# Altium project MelansonTech Isolated Current Sense.PrjPcb
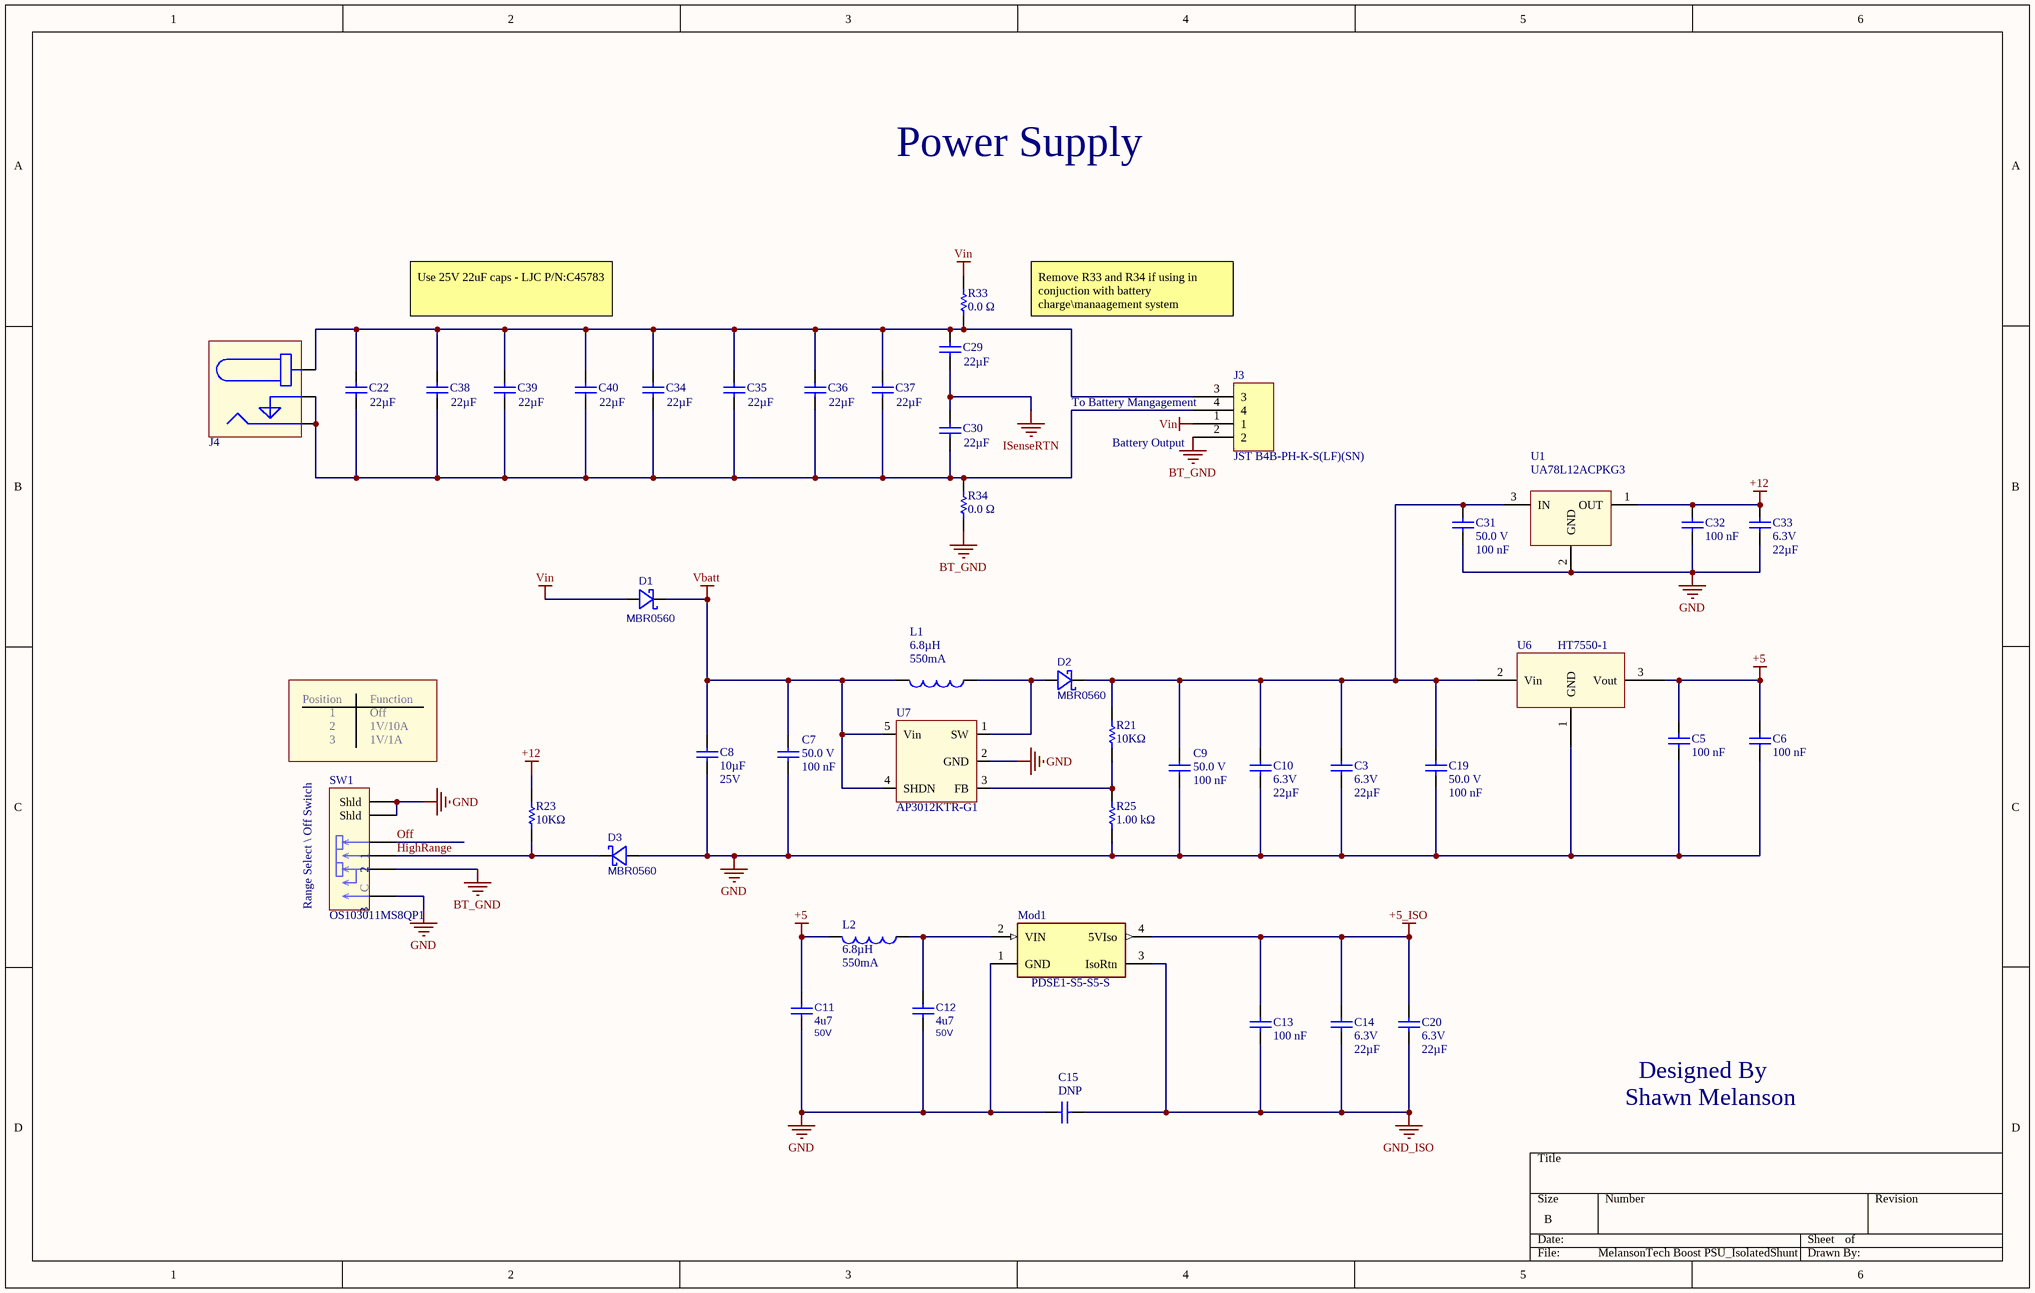
[diagram p0: MelansonTech Boost PSU_IsolatedShuntAmp.SchDoc]
2 sheets, 102 parts. Net scope: global (net labels, ports and power ports of the same name join across sheets).
Sheets:
  MelansonTech Boost PSU_IsolatedShuntAmp.SchDoc
  MelansonTech Isolated Shunt Amplifier.SchDoc

## Sheet MelansonTech Boost PSU_IsolatedShuntAmp.SchDoc
size B

### Parts
C3  Voltage - Rated: 6.3V  Capacitance: 22µF  [Cap,0805]  (hidden comment: CL21A226MQQNNNE)
C5  Capacitance: 100 nF  [CAP, 0805, HD]  (hidden comment: 08055C104JAT2A)
C6  Capacitance: 100 nF  [CAP, 0805, HD]  (hidden comment: 08055C104JAT2A)
C7  Voltage Rating (DC): 50.0 V  Capacitance: 100 nF  [Cap,0805]  (hidden comment: Cap)
C8  Capacitance: 10µF  Voltage - Rated: 25V  [Cap, 1206]  (hidden comment: C3216X7R1E106K160AB)
C9  Voltage Rating (DC): 50.0 V  Capacitance: 100 nF  [Cap,0805]  (hidden comment: Cap)
C10  Voltage - Rated: 6.3V  Capacitance: 22µF  [Cap,0805]  (hidden comment: CL21A226MQQNNNE)
C11  Capacitance: 4u7  Voltage: 50V  [Cap, 1206]  (hidden comment: CL31B475KBHNNNE)
C12  Capacitance: 4u7  Voltage: 50V  [Cap, 1206]  (hidden comment: CL31B475KBHNNNE)
C13  Capacitance: 100 nF  [CAP, 0805, HD]  (hidden comment: 08055C104JAT2A)
C14  Voltage - Rated: 6.3V  Capacitance: 22µF  [Cap,0805]  (hidden comment: CL21A226MQQNNNE)
C15  S102K33Y5PP63K5R  [Cap, 5mm Lead Spaceing, 4mm dai]  (value not drawn)
C19  Voltage Rating (DC): 50.0 V  Capacitance: 100 nF  [Cap,0805]  (hidden comment: Cap)
C20  Voltage - Rated: 6.3V  Capacitance: 22µF  [Cap,0805]  (hidden comment: CL21A226MQQNNNE)
C22  Capacitance: 22µF  [Cap,0805]  (hidden comment: CL21A226MQQNNNE)
C29  Capacitance: 22µF  [Cap,0805]  (hidden comment: CL21A226MQQNNNE)
C30  Capacitance: 22µF  [Cap,0805]  (hidden comment: CL21A226MQQNNNE)
C31  Voltage Rating (DC): 50.0 V  Capacitance: 100 nF  [Cap,0805]  (hidden comment: Cap)
C32  Capacitance: 100 nF  [CAP, 0805, HD]  (hidden comment: 08055C104JAT2A)
C33  Voltage - Rated: 6.3V  Capacitance: 22µF  [Cap,0805]  (hidden comment: CL21A226MQQNNNE)
C34  Capacitance: 22µF  [Cap,0805]  (hidden comment: CL21A226MQQNNNE)
C35  Capacitance: 22µF  [Cap,0805]  (hidden comment: CL21A226MQQNNNE)
C36  Capacitance: 22µF  [Cap,0805]  (hidden comment: CL21A226MQQNNNE)
C37  Capacitance: 22µF  [Cap,0805]  (hidden comment: CL21A226MQQNNNE)
C38  Capacitance: 22µF  [Cap,0805]  (hidden comment: CL21A226MQQNNNE)
C39  Capacitance: 22µF  [Cap,0805]  (hidden comment: CL21A226MQQNNNE)
C40  Capacitance: 22µF  [Cap,0805]  (hidden comment: CL21A226MQQNNNE)
D1  MBR0560  [SOD123]
D2  MBR0560  [SOD123]
D3  MBR0560  [SOD123]
J3  JST B4B-PH-K-S(LF)(SN)  [Conn, JST, 4 pin, 2mm spacing Right Angle]
J4  PJ-002A  [Connector,Barrel,2.1mm,5.5mm,DC power Jack]  (value not drawn)
L1  Inductance: 6.8µH  Current Rating (Amps): 550mA  [Ind, 0805]  (hidden comment: MLZ2012N6R8LT000)
L2  Inductance: 6.8µH  Current Rating (Amps): 550mA  [Ind, 0805]  (hidden comment: MLZ2012N6R8LT000)
Mod1  PDSE1-S5-S5-S  [CONV_PDSE1-S5-S5-S]
R21  Resistance: 10KΩ  [res, 0805, HD]  (hidden comment: Vishay / Dale CRCW080510K0FKTA)
R23  Resistance: 10KΩ  [res, 0805, HD]  (hidden comment: Vishay / Dale CRCW080510K0FKTA)
R25  Resistance: 1.00 kΩ  [res, 0805, HD]  (hidden comment: Vishay CRCW08051K00JNEA)
R33  Resistance: 0.0 Ω  [res, 0805, HD]  (hidden comment: CR0805-J/-000ELF)
R34  Resistance: 0.0 Ω  [res, 0805, HD]  (hidden comment: CR0805-J/-000ELF)
SW1  OS103011MS8QP1  [Switch,Slide,.SP3T, OS103011 -Side]
U1  UA78L12ACPKG3  [SOT89-3]
U6  HT7550-1  [SOT89-3]
U7  AP3012KTR-G1  [SOT23-5]

### Nets
+5: C5.2 C6.2 C11.2 L2.2 U6.3(Vout)
+5_ISO: C13.2 C14.2 C20.2 Mod1.4(5VIso)
+12: C32.2 C33.2 R23.1 U1.1(OUT)
BT_GND: J3.2 R34.2 SW1.2
GND: C3.1 C5.1 C6.1 C7.1 C8.1 C9.1 C10.1 C11.1 C12.1 C15.2 C19.1 C31.1 C32.1 C33.1 D3.2(A) Mod1.1(GND) R25.2 SW1.1 SW1.5(Shld) SW1.6(Shld) U1.2(GND) U6.1(GND) U7.2(GND)
GND_ISO: C13.1 C14.1 C15.1 C20.1 Mod1.3(IsoRtn)
ISenseRTN: C29.1 C30.2
Vbatt: C7.2 C8.2 D1.1(C) L1.2 U7.4(SHDN) U7.5(Vin)
Vin: D1.2(A) J3.1 R33.1
HighRange: D3.1(C) R23.2 SW1.3
Off: SW1.4
NetC3_2: C3.2 C9.2 C10.2 C19.2 C31.2 D2.1(C) R21.2 U1.3(IN) U6.2(Vin)
NetC12_2: C12.2 L2.1 Mod1.2(VIN)
NetC22_1: C22.1 C30.1 C34.1 C35.1 C36.1 C37.1 C38.1 C39.1 C40.1 J3.4 J4.2 J4.3 R34.1
NetC22_2: C22.2 C29.2 C34.2 C35.2 C36.2 C37.2 C38.2 C39.2 C40.2 J3.3 J4.1 R33.2
NetD2_2: D2.2(A) L1.1 U7.1(SW)
NetR21_1: R21.1 R25.1 U7.3(FB)

### Notes on the sheet
- Power Supply
- Use 25V 22uF caps - LJC P/N:C45783
- Remove R33 and R34 if using in conjuction with battery charge\manaagement system
- (near J3) To Battery Mangagement
- (near J3) Battery Output
- Position
- Function
- 1
- 2
- 3
- Off
- 1V/10A
- 1V/1A
- Range Select \ Off Switch
- (near C15) DNP
- Shawn Melanson
- Designed By
- (in symbol Switch,TH,Slide,SP3T,100MA,12V,OS103011MS8QP1) C

### Library data of the parts
C3 C10 C14 C20 C22 C29 C30 C33-C40 = Cap,0805,22uF,6.3V,X5R,±20%,CL21A226MQQNNNE: CAP CER 22UF 6.3V X5R 0805; Manufacturer: Samsung Electro-Mechanics; Detailed Description: 22 µF ±20% 6.3V Ceramic Capacitor X5R 0805 (2012 Metric); Tolerance: ±20%; mfg P/N: CL21A226MQQNNNE; Category: Capacitors  Ceramic Capacitors; Series: CL; Part Status: Active; Temperature Coefficient: X5R; Operating Temperature: -55°C ~ 85°C; Applications: General Purpose; Mounting Type: Surface Mount, MLCC; Package / Case: 0805 (2012 Metric); Size / Dimension: 0.079" L x 0.049" W (2.00mm x 1.25mm); Thickness (Max): 0.055" (1.40mm)
  C22 C29 C30 C34-C40: Voltage - Rated: 6.3V
C5 C6 C13 C32 = Cap,0805,100nf,50V,5%,08055C104JAT2A: Capacitor; Ceramic; Cap 0.1 uF; Tol 5%; Vol-Rtg 50 VDC; SMT; 0805; X7R; Tape & Reel; Lead-Free Status: Lead Free; Voltage Rating (DC): 50.0 V; Case/Package (SI): 2012; Insulation Resistance: 100 GΩ; Detailed Description: 0.1µF ±5% 50V Ceramic Capacitor X7R 0805 (2012 Metric); Mounting Style: Surface Mount; Packaging: Tape & Reel (TR), Cut Tape (CT); RoHS: Compliant; Size-Width: 1.24 mm; Case/Package: 0805; Number of Pins: 2; digikey url: http://www.digikey.ca/product-detail/en/avx-corporation/08055C104JAT2A/478-3352-1-ND/930144; REACH SVHC Compliance: No SVHC; Dielectric Characteristic: X7R; Capacitance Tolerance: ±5%; Size-Length: 2.01 mm; Size-Height: 710 µm; Size-Thickness: 940 µm; Manufacturer Part Number: 08055C104JAT2A; Octopart URL: http://octopart.com/08055c104jat2a-avx-55388010; Operating Temperature: -55°C ~ 125°C
C7 C9 C19 C31 = Cap,0805,100nf,50V,5%,08055C104JAT2A: Capacitor; Ceramic; Cap 0.1 uF; Tol 5%; Vol-Rtg 50 VDC; SMT; 0805; X7R; Tape & Reel; Lead-Free Status: Lead Free; Case/Package (SI): 2012; Insulation Resistance: 100 GΩ; Detailed Description: 0.1µF ±5% 50V Ceramic Capacitor X7R 0805 (2012 Metric); Mounting Style: Surface Mount; Packaging: Tape & Reel (TR), Cut Tape (CT); RoHS: Compliant; Size-Width: 1.24 mm; Case/Package: 0805; Number of Pins: 2; digikey url: http://www.digikey.ca/product-detail/en/avx-corporation/08055C104JAT2A/478-3352-1-ND/930144; REACH SVHC Compliance: No SVHC; Dielectric Characteristic: X7R; Capacitance Tolerance: ±5%; Size-Length: 2.01 mm; Size-Height: 710 µm; Size-Thickness: 940 µm; Manufacturer Part Number: 08055C104JAT2A; Octopart URL: http://octopart.com/08055c104jat2a-avx-55388010; Operating Temperature: -55°C ~ 125°C
C8 = CAP,1206,10uF,25V,C3216X7R1E106K160AB: 10µF ±10% 25V Ceramic Capacitor X7R 1206 (3216 Metric); Manufacturer: TDK Corporation; Features Low: ESL; mfg P/N: C3216X7R1E106K160AB; Tolerance: ±10%; Temperature Coefficient: X7R; Operating Temperature: -55°C ~ 125°C; Applications: General Purpose; Mounting Type: Surface Mount, MLCC; Package / Case: 1206 (3216 Metric); Size / Dimension: 0.126" L x 0.063" W (3.20mm x 1.60mm); Thickness (Max): 0.075" (1.90mm); Supplier 1: Digi-Key; Supplier Part Number 1: 445-7705-1-ND
C11 C12 = Cap,1206,4.7uF,10%,50V,CL31B475KBHNNNE: Cap,SMD,MLCC,4u7,50V,X7R,10%,1206; Manufacturer: Samsung; Manufacturer P/N: CL31B475KBHNNNE; Tolerance: 10%; Package: 1206; Supplier 1: LCSC; Supplier Part Number 1: C51205; Supplier 2: Digi-Key; Supplier Part Number 2: 1276-2789-1-ND
C15 = Cap,TH,Ceramic,5mm Spacing,1nF,2kV, S102K33Y5PP63K5R: CAP CER 1000PF 2KV Y5P RADIAL; Manufacturer: Vishay BC Components; Detailed Description: 1000pF ±10% 2000V (2kV) Ceramic Capacitor Y5P (B) Radial, Disc; Tolerance: ±10%; Temperature Coefficient: Y5P (B); Voltage - Rated: 2000V (2kV); Capacitance: 1nF; mfg P/N: S102K33Y5PP63K5R; Category: Capacitors  Ceramic Capacitors; Series: S; Part Status: Active; Operating Temperature: -30°C ~ 125°C; Applications: General Purpose; Mounting Type: Through Hole; Package / Case: Radial, Disc; Size / Dimension: 0.335"" Dia (8.50mm); Height - Seated (Max): 0.492"" (12.50mm); Lead Spacing: 0.197"" (5.00mm); Lead Style: Formed Leads - Kinked
D1-D3 = Diode,SOD123,Shottky,60V,0.5A,MBR0560: Dio,Sig,Schtky,0.5A,60V,SOD123; Manufacturer: MCC; mfg P/N: MBR0560-TP; Details: 700mV @ 500mA, 200µA @ 60V,30pF @ 4V, 1MHz; Not Stuffed: N/S; Fast Supplier: Digi-Key; Current: 0.5A; Package: SOD123; Voltage: 60V; Supplier 1: Digi-Key; Supplier Part Number 1: MBR0560TPMSCT-ND; Supplier 2: LCSC; Supplier Part Number 2: C150515
J3 = Conntector, though hole, JST, 4pin, 2mm,B4B-PH-K-S(LF)(SN): PH Series 4 Position 2 mm Pitch Through Hole Crimp Top Entry Shrouded Header; Voltage Rating (AC): 100 V; Insulation Resistance: 1.00 MΩ; Number of Contacts: 4; Contact Resistance: 10.0 mΩ; REACH SVHC Compliance: No SVHC; Mounting Style: Through Hole, Vertical; Manufacturer Part Number: B4B-PH-K-S(LF)(SN); Size-Width: 4.50 mm; Number of Positions: 4; Size-Height: 6.00 mm; Size-Length: 9.90 mm; Supplier 1: Farnell; Supplier 2: Newark; Supplier 3: Digi-Key; Supplier 4: Digi-Key; Supplier Part Number 4: 455-1706-ND
J4 = Connector,Barrel,ID 2.1mm,OD 5.5mm,Power Connect, PJ-002A: Power Barrel Connector Jack 2.10mm ID (0.083"), 5.50mm OD (0.217") Through Hole, Right Angle; Manufacturer: CUI Inc.; Actual Diameter: 0.079" (2.00mm ID), 0.256" (6.50mm OD); Number of Positions/Contacts: 2 Conductors, 3 Contacts; Mating Length/Depth: 0.354" (9.00mm); Dielectric Material: Polybutylene Terephthalate (PBT); Internal Switch(s): Does Not Contain Switch; Shielding: Unshielded; Voltage - Rated: 24VDC; Current Rating (Amps): 2.5A; Material Flammability Rating: UL94 V-0; Body Color: Black; mfg P\N: PJ-002A; Industry Recognized Mating Diameter: 2.10mm ID (0.083"), 5.50mm OD (0.217"); Connector Type: Jack; Mounting Type: Through Hole, Right Angle; Termination: Solder Eyelet(s); Contact Material - Plating: Tin; Operating Temperature: -25°C ~ 85°C; Contact Material: Brass, Copper Alloy; Supplier 1: Digi-Key; Supplier Part Number 1: CP-002A-ND
L1 L2 = Ind,0805,6.8uH,550mA,0.25Ω, MLZ2012N6R8LT000: FIXED IND 6.8UH 550MA 250 MOHM; Manufacturer: TDK Corporation; Detailed Description: 6.8µH Shielded Multilayer Inductor 550mA 250mOhm 0805 (2012 Metric); Type: Multilayer; Material - Core: Ferrite; Tolerance: ±20%; Current - Saturation: 110mA; Shielding: Shielded; Frequency - Self Resonant: 60MHz; Inductance Frequency - Test: 2MHz; mfg P/N: MLZ2012N6R8LT000; Category: Inductors, Coils, Chokes  Fixed Inductors; Series: MLZ; Part Status: Active; DC Resistance (DCR): 250mOhm; Operating Temperature: -55°C ~ 125°C; Mounting Type: Surface Mount; Package / Case: 0805 (2012 Metric); Supplier Device Package: 0805 (2012 Metric); Size / Dimension: 0.079"" L x 0.049"" W (2.00mm x 1.25mm); Height - Seated (Max): 0.041"" (1.05mm); Supplier 1: Digi-Key; Supplier Part Number 1: 445-6761-1-ND; Supplier 2: LCSC; Supplier Part Number 2: C82157
Mod1 = Mod,PSU,4.5-5.5Vin,5Vout,1W, PDSE1-S5-S5-S: DC-DC ISOLATED, 1 W, 4.5-5.5 VDC; Manufacturer: CUI Inc.; Detailed Description: Isolated Module DC DC Converter 1 Output 5V    200mA 4.5V - 5.5V Input; Voltage - Isolation: 3kV; Voltage - Input (Min): 4.5V; Voltage - Input (Max): 5.5V; Voltage - Output 1: 5V; Current - Output (Max): 200mA; Efficiency: 82%; Approval Agency: CE, cURus; Number of Outputs: 1; Power (Watts): 1W; mfg P/N: PDSE1-S5-S5-S; Series: PDSE1-S (1W); Category: Power Supplies - Board Mount  DC DC Converters; Part Status: Active; Type: Isolated Module; Applications: ITE (Commercial); Features: SCP; Operating Temperature: -40°C ~ 105°C (With Derating); Mounting Type: Through Hole; Package / Case: 4-SIP Module; Size / Dimension: 0.46"" L x 0.24"" W x 0.40"" H (11.6mm x 6.0mm x 10.2mm); Supplier 1: Digi-Key; Supplier Part Number 1: 102-6291-ND
R21 R23 = Res,0805,10.0kΩ,1%,100 ppm,CRCW080510K0FKTA: RES SMD 10K OHM 1% 1/8W 0805; Temperature Coefficient: 100.0 ppm/C; Lead-Free Status: Contains Lead; Voltage Rating (DC): 150.0 V; Power Rating: 0.125 W; Case/Package (SI): 2012; Size-Width: 0.00125 m; Resistance Tolerance: 1%; Size-Length: 0.002 m; RoHS: Non-Compliant; Power Dissipation: 0.125 W; Number of Pins: 2; REACH SVHC Compliance: No SVHC; Size-Height: 0.00045 m; Case/Package: 0805; Mounting Style: Surface Mount; Supplier 1: Digi-Key; Supplier Part Number 1: 541-3016-1-ND
R25 = Res,0805,1.00 kΩ,5%,200ppm,CRCW08051K00JNEA: Res Thick Film 0805 1K Ohm 5% 0.125W(1/8W) ±200ppm/C Molded SMD Automotive Paper T/R; Power Rating: 125 mW; Case/Package (SI): 2012; Lead-Free Status: Lead Free; Temperature Coefficient: 200 ppm/°C; Voltage Rating (DC): 150 V; Size-Width: 1.25 mm; Mounting Style: Surface Mount; REACH SVHC Compliance: No SVHC; Manufacturer Part Number: CRCW08051K00JNEA; Number of Pins: 2; Size-Height: 450 µm; Packaging: Tape & Reel (TR), Cut Tape (CT); RoHS: Compliant; Resistance Tolerance: ±5%; Case/Package: 0805; Size-Length: 2.00 mm; Supplier 1: Digi-Key; Supplier Part Number 1: 541-1.0KADKR-ND; Supplier 2: Digi-Key; Supplier Part Number 2: 541-1.0KACT-ND
R33 R34 = Res,0805,0.0Ω,150V, CR0805-J/-000ELF: RES SMD 0 OHM JUMPER 1/8W 0805; Lead-Free Status: Lead Free; Power Rating: 0.125 W; Voltage Rating (DC): 150.0 V; Detailed Description: 0 Ohms Jumper 0.125W, 1/8W Chip Resistor 0805 (2012 Metric) Moisture Resistant Thick Film; Categories: Resistors   Chip Resistor - Surface Mount; Case/Package: 0805; Number of Pins: 2; RoHS: Compliant; Tolerance: Jumper; Composition: Thick Film; Operating Temperature: -55°C ~ 155°C; Base Part Number: CR0805; Supplier 1: Digi-Key; Supplier Part Number 1: CR0805-J/-000ELFCT-ND; Supplier 2: Digi-Key; Supplier Part Number 2: CR0805-J/-000ELFDKR-ND
SW1 = Switch,TH,Slide,SP3T,100MA,12V,OS103011MS8QP1: SWITCH SLIDE SP3T 100MA 12V; Manufacturer: C&K; Detailed Description: Slide Switch SP3T Through Hole; Switch Function: On-On-On; Current Rating (Amps): 100mA (DC); Actuator Type: Standard; Actuator Length: 4.00mm; Actuator Material: Polyoxymethylene (Acetal) (POM); Switch Travel: 2.00mm; Mechanical Life: 10,000 Cycles; mfg P/N: OS103011MS8QP1; Part Status: Active; Circuit: SP3T; Voltage Rating - DC: 12V; Contact Material: Copper Alloy; Contact Finish: Silver; Mounting Type: Through Hole; Termination Style: PC Pin; Features: Epoxy Sealed Terminals; Operating Temperature: -30°C ~ 70°C; Electrical Life: 10,000 Cycles; Supplier 1: Digi-Key; Supplier Part Number 1: CKN9543-ND; Supplier 2: LCSC; Supplier Part Number 2: C221831
U1 = Reg,Linear,Pos,Fixed,12Vout,27Vin,100mA,UA78L12ACPKG3: IC REG LINEAR 12V 100MA SOT89-3; Manufacturer: Texas Instruments; Detailed Description: Linear Voltage Regulator IC Positive Fixed 1 Output 100mA SOT-89-3; Output Configuration: Positive; Output Type: Fixed; Voltage - Input (Max): 27V; Voltage Dropout (Max): 1.7V @ 40mA; PSRR: 42dB (120Hz); Protection Features: Over Current, Over Temperature, Reverse Polarity, Short Circuit; Number of Regulators: 1; mfg P/N: UA78L12ACPKG3; Category: Integrated Circuits (ICs)  PMIC - Voltage Regulators - Linear; Part Status: Active; Voltage - Output (Min/Fixed): 12V; Current - Output: 100mA; Operating Temperature: 0°C ~ 125°C; Mounting Type: Surface Mount; Package / Case: TO-243AA; Supplier Device Package: SOT-89-3; Base Product Number: UA78L12; Supplier 1: Digi-Key; Supplier Part Number 1: 296-50454-6-ND; Supplier 2: Mouser; Supplier Part Number 2: 595-UA78L12ACPKG3; Supplier 3: Arrow Electronics; Supplier Part Number 3: UA78L12ACPKG3
U6 = Reg,Linear,Fixed,SOT-89-3,30Vin,5Vout,150mA,HT7550-1: LOW DROPOUT REGULATORS(LDO) POSITIVE FIXED 55MV @ 1MA 30V 5V 150MA SOT-89(SOT-89-3) ROHS; Manufacturer: Holtek Semicon; Input Voltage (Max): 30Vdc; Output voltage accuracy: tolerance ±3%; Quiescent current: 2.5μA; Output Voltage: 5Vdc; LCSC Part #: C16106; Package: SOT-89-3; Output Current (Max): 150mA; mfg P/N: HT7550-1
U7 = Reg,Switching,Boost,2.6-16Vin,29Vout,0.5A, AP3012KTR-G1: IC REG BOOST ADJ 500MA SOT23-5; Manufacturer: Diodes Incorporated; Detailed Description: Boost Switching Regulator IC Positive Adjustable 1.25V 1 Output 500mA (Switch) SC-74A, SOT-753; Function: Step-Up; Output Configuration: Positive; Output Type: Adjustable; Number of Outputs: 1; Voltage - Input (Min): 2.6V; Voltage - Input (Max): 16V; Voltage - Output (Min/Fixed): 1.25V; Voltage - Output (Max): 29V; Current - Output 500mA: (Switch); Frequency - Switching: 1.5MHz; S ynchronous Rectifier: No; Part Status: Active; Topology: Boost; Operating Temperature: -40°C ~ 85°C (TA); Mounting Type: Surface Mount; Package / Case: SC-74A, SOT-753; Supplier Device: Package SOT-23-5; Supplier 1: Digi-Key; Supplier Part Number 1: AP3012KTR-G1DICT-ND; Supplier 2: LCSC; Supplier Part Number 2: C102618; mfg P/N: AP3012KTR-G1

## Sheet MelansonTech Isolated Shunt Amplifier.SchDoc
size C
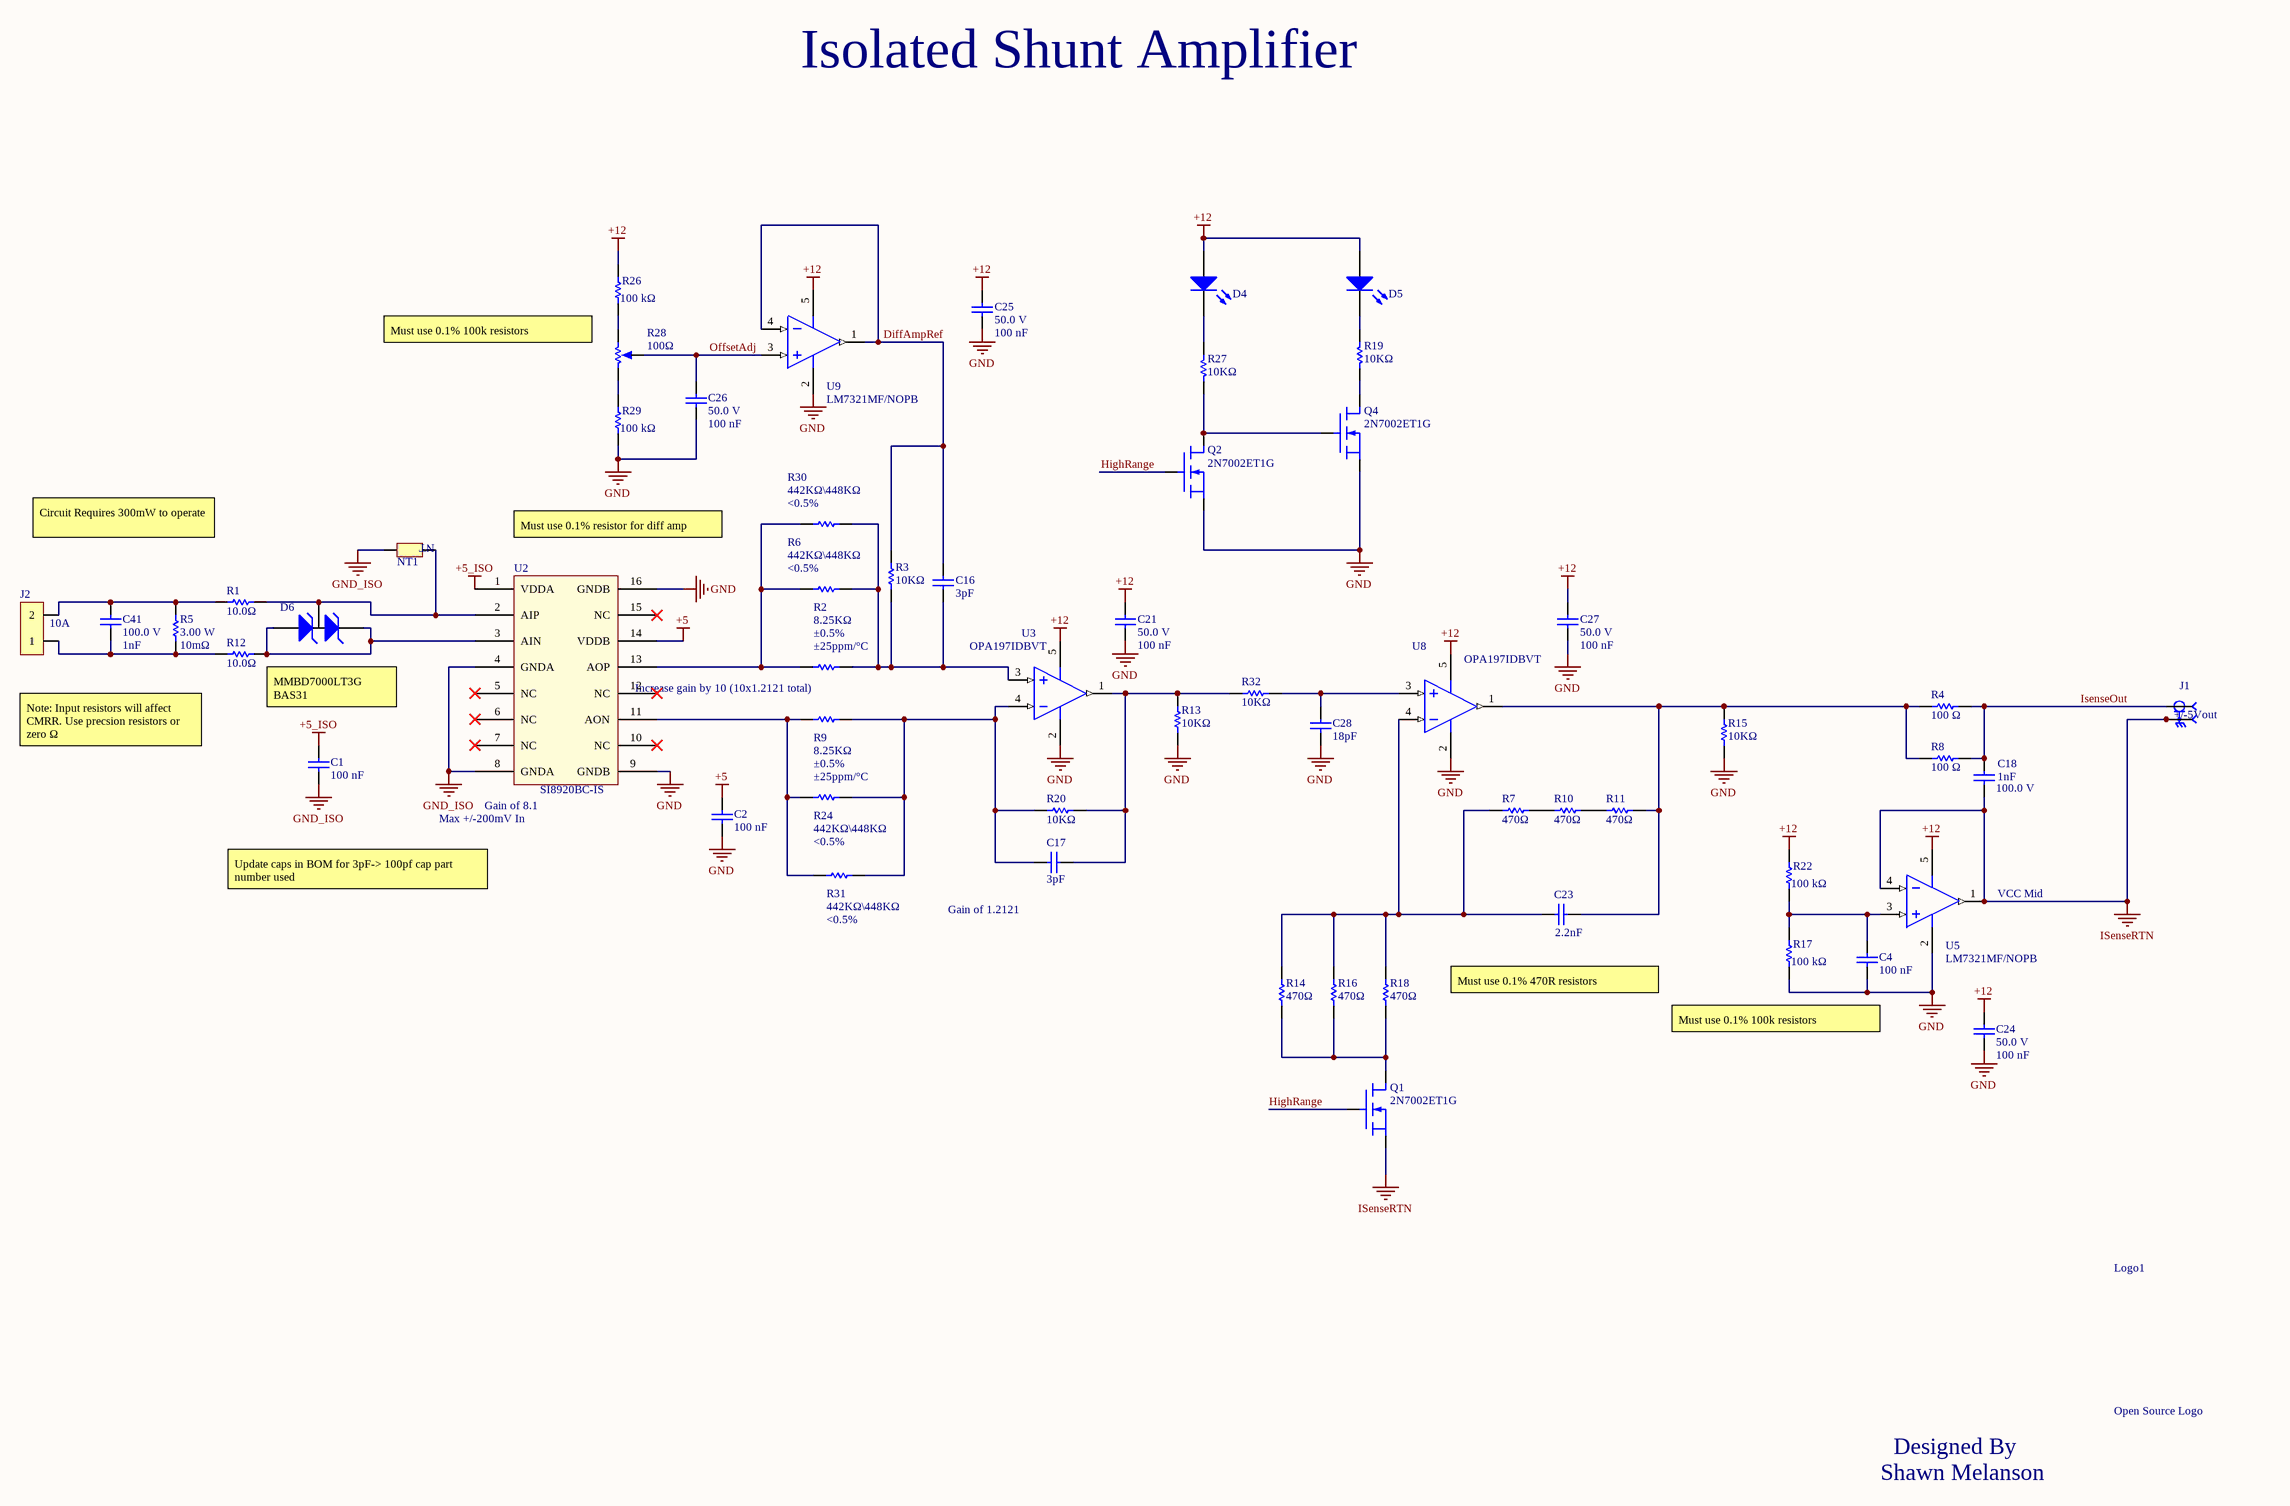
[diagram p1: MelansonTech Isolated Shunt Amplifier.SchDoc]

### Parts
C1  Capacitance: 100 nF  [CAP, 0805, HD]  (hidden comment: 08055C104JAT2A)
C2  Capacitance: 100 nF  [CAP, 0805, HD]  (hidden comment: 08055C104JAT2A)
C4  Capacitance: 100 nF  [CAP, 0805, HD]  (hidden comment: 08055C104JAT2A)
C16  Capacitance: 3pF  [CAP, 0805, HD]  (hidden comment: GRM21A5C2E101JW01D)
C17  Capacitance: 3pF  [CAP, 0805, HD]  (hidden comment: GRM21A5C2E101JW01D)
C18  Voltage Rating (DC): 100.0 V  Capacitance: 1nF  [CAP, 0805, HD]  (hidden comment: C0805X102J1GACAUTO)
C21  Voltage Rating (DC): 50.0 V  Capacitance: 100 nF  [CAP, 0805, HD]  (hidden comment: 08055C104JAT2A)
C23  Cap: 2.2nF  [CAP, 0805, HD]  (hidden comment: Cap)
C24  Voltage Rating (DC): 50.0 V  Capacitance: 100 nF  [CAP, 0805, HD]  (hidden comment: 08055C104JAT2A)
C25  Voltage Rating (DC): 50.0 V  Capacitance: 100 nF  [CAP, 0805, HD]  (hidden comment: 08055C104JAT2A)
C26  Voltage Rating (DC): 50.0 V  Capacitance: 100 nF  [CAP, 0805, HD]  (hidden comment: 08055C104JAT2A)
C27  Voltage Rating (DC): 50.0 V  Capacitance: 100 nF  [CAP, 0805, HD]  (hidden comment: 08055C104JAT2A)
C28  Capacitance: 18pF  [CAP, 0805, HD]  (hidden comment: GRM21A5C2E101JW01D)
C41  Voltage Rating (DC): 100.0 V  Capacitance: 1nF  [CAP, 0805, HD]  (hidden comment: C0805X102J1GACAUTO)
D4  OVLBB4C7  [LED,TH,T1,3MM-Vert]  (value not drawn)
D5  OVLBB4C7  [LED,TH,T1,3MM-Vert]  (value not drawn)
D6  BAT54SLT1G  [SOT23-3]  (value not drawn)
J1  142-0701-801  [CINCH_142-0701-801]  (value not drawn)
J2  TE Connectivity 282836-2  [TERM BLOCK 2POS SIDE ENTRY 5MM]  (value not drawn)
Logo1  Open Source Logo  [Symbol,Open Source - No Text]
NT1  Net Tie,0.254mm  [0.254mm Net Tie]  (value not drawn)  (net tie, no BOM)
Q1  2N7002ET1G  [SOT23-3]
Q2  2N7002ET1G  [SOT23-3]
Q4  2N7002ET1G  [SOT23-3]
R1  Resistance: 10.0Ω  [res, 0805, HD]  (hidden comment: Vishay CRCW08051K00JNEA)
R2  Tolerance: ±0.5%  Temperature Coefficient: ±25ppm/°C  Resistance: 8.25KΩ  [res, 0805, HD]  (hidden comment: RR1220P-8251-D-M)
R3  Resistance: 10KΩ  [res, 0805, HD]  (hidden comment: Vishay / Dale CRCW080510K0FKTA)
R4  Resistance: 100 Ω  [res, 0805, HD]  (hidden comment: CRCW0805100RJNEAC)
R5  Power Rating: 3.00 W  Resistance: 10mΩ  [Res 2512]  (hidden comment: Res1)
R6  Resistance: 442KΩ\448KΩ  Tolerance: <0.5%  [res, 0805, HD]
R7  Resistance: 470Ω  [res, 0805, HD]  (hidden comment: CR0805-JW-471ELF)
R8  Resistance: 100 Ω  [res, 0805, HD]  (hidden comment: CRCW0805100RJNEAC)
R9  Tolerance: ±0.5%  Temperature Coefficient: ±25ppm/°C  Resistance: 8.25KΩ  [res, 0805, HD]  (hidden comment: RR1220P-8251-D-M)
R10  Resistance: 470Ω  [res, 0805, HD]  (hidden comment: CR0805-JW-471ELF)
R11  Resistance: 470Ω  [res, 0805, HD]  (hidden comment: CR0805-JW-471ELF)
R12  Resistance: 10.0Ω  [res, 0805, HD]  (hidden comment: Vishay / Dale CRCW080510K0FKTA)
R13  Resistance: 10KΩ  [res, 0805, HD]  (hidden comment: Vishay / Dale CRCW080510K0FKTA)
R14  Resistance: 470Ω  [res, 0805, HD]  (hidden comment: CR0805-JW-471ELF)
R15  Resistance: 10KΩ  [res, 0805, HD]  (hidden comment: Vishay / Dale CRCW080510K0FKTA)
R16  Resistance: 470Ω  [res, 0805, HD]  (hidden comment: CR0805-JW-471ELF)
R17  Resistance: 100 kΩ  [res, 0805, HD]  (hidden comment: CRCW0805100KFKEA)
R18  Resistance: 470Ω  [res, 0805, HD]  (hidden comment: CR0805-JW-471ELF)
R19  Resistance: 10KΩ  [res, 0805, HD]  (hidden comment: Vishay / Dale CRCW080510K0FKTA)
R20  Resistance: 10KΩ  [res, 0805, HD]  (hidden comment: Vishay / Dale CRCW080510K0FKTA)
R22  Resistance: 100 kΩ  [res, 0805, HD]  (hidden comment: CRCW0805100KFKEA)
R24  Resistance: 442KΩ\448KΩ  Tolerance: <0.5%  [res, 0805, HD]
R26  Resistance: 100 kΩ  [res, 0805, HD]  (hidden comment: CRCW0805100KFKEA)
R27  Resistance: 10KΩ  [res, 0805, HD]  (hidden comment: Vishay / Dale CRCW080510K0FKTA)
R28  Resistance: 100Ω  [Res,SMD,POT,TC33 Series]  (hidden comment: TC33X-2-101E)
R29  Resistance: 100 kΩ  [res, 0805, HD]  (hidden comment: CRCW0805100KFKEA)
R30  Resistance: 442KΩ\448KΩ  Tolerance: <0.5%  [res, 0805, HD]
R31  Resistance: 442KΩ\448KΩ  Tolerance: <0.5%  [res, 0805, HD]
R32  Resistance: 10KΩ  [res, 0805, HD]  (hidden comment: Vishay / Dale CRCW080510K0FKTA)
U2  SI8920BC-IS  [SOIC-16 - Wide]
U3  OPA197IDBVT  [SOT23-5]
U5  LM7321MF/NOPB  [SOT23-5]
U8  OPA197IDBVT  [SOT23-5]
U9  LM7321MF/NOPB  [SOT23-5]

### Nets
+5: C2.2 U2.14(VDDB)
+5_ISO: C1.2 U2.1(VDDA)
+12: C21.2 C24.2 C25.2 C27.2 D4.1(A) D5.1(A) R22.2 R26.2 U3.5(V+) U5.5(V+) U8.5(V+) U9.5(V+)
GND: C2.1 C4.1 C21.1 C24.1 C25.1 C26.1 C27.1 C28.2 Q2.2(S) Q4.2(S) R13.2 R15.1 R17.1 R29.1 U2.9(GNDB) U2.16(GNDB) U3.2(V-) U5.2(V-) U8.2(V-) U9.2(V-)
GND_ISO: C1.1 NT1.2 U2.4(GNDA) U2.8(GNDA)
ISenseRTN: C18.1 J1.S1 J1.S2 J1.S3 J1.S4 Q1.2(S) U5.1(OUT) U5.4(IN-)
DiffAmpRef: C16.1 R3.1 U9.1(OUT) U9.4(IN-)
HighRange: Q1.1(G) Q2.1(G)
IsenseOut: C18.2 J1.1 R4.1 R8.1
OffsetAdj: C26.2 R28.2 U9.3(IN+)
NetC4_2: C4.2 R17.2 R22.1 U5.3(IN+)
NetC16_2: C16.2 R2.1 R3.2 R6.1 R30.1 U3.3(1IN+)
NetC17_1: C17.1 R13.1 R20.1 R32.1 U3.1(1OUT)
NetC17_2: C17.2 R9.1 R20.2 R24.1 R31.1 U3.4(1IN-)
NetC23_1: C23.1 R4.2 R8.2 R11.1 R15.2 U8.1(1OUT)
NetC23_2: C23.2 R7.2 R14.1 R16.1 R18.1 U8.4(1IN-)
NetC28_1: C28.1 R32.2 U8.3(1IN+)
NetC41_1: C41.1 J2.1 R5.2 R12.2
NetC41_2: C41.2 J2.2 R1.2 R5.1
NetD4_2: D4.2(K) R27.1
NetD5_2: D5.2(K) R19.1
NetD6_1: D6.1(A) D6.2(K) R12.1 U2.3(AIN)
NetD6_3: D6.3(AK) NT1.1 R1.1 U2.2(AIP)
NetQ1_3: Q1.3(D) R14.2 R16.2 R18.2
NetQ2_3: Q2.3(D) Q4.1(G) R27.2
NetQ4_3: Q4.3(D) R19.2
NetR2_2: R2.2 R6.2 R30.2 U2.13(AOP)
NetR7_1: R7.1 R10.2
NetR9_2: R9.2 R24.2 R31.2 U2.11(AON)
NetR10_1: R10.1 R11.2
NetR26_1: R26.1 R28.3
NetR28_1: R28.1 R29.2

Not connected (* = marked no-connect by the designer): U2 5(NC)* 6(NC)* 7(NC)* 10(NC)* 12(NC)* 15(NC)*

### Notes on the sheet
- Isolated Shunt Amplifier
- Must use 0.1% 100k resistors
- Circuit Requires 300mW to operate
- Must use 0.1% resistor for diff amp
- 10A
- (near R12) MMBD7000LT3G
  BAS31
- (near U3) Increase gain by 10 (10x1.2121 total)
- (near J1) +/-5Vout
- Note: Input resistors will affect CMRR. Use precsion resistors or zero Ω
- (near U2) Max +/-200mV In
- (near U2) Gain of 8.1
- Update caps in BOM for 3pF-> 100pf cap part number used
- (near C17) Gain of 1.2121
- (near U5) VCC Mid
- Must use 0.1% 470R resistors
- Shawn Melanson
- Designed By
- (in symbol Net Tie,0.254mm) NT

### Library data of the parts
C1 C2 C4 = Cap,0805,100nf,50V,5%,08055C104JAT2A: as C5 on sheet MelansonTech Boost PSU_IsolatedShuntAmp; Mounting Style: Surface Mount; Packaging: Tape & Reel (TR), Cut Tape (CT); RoHS: Compliant; Size-Width: 1.24 mm; Case/Package: 0805; Number of Pins: 2; digikey url: http://www.digikey.ca/product-detail/en/avx-corporation/08055C104JAT2A/478-3352-1-ND/930144; REACH SVHC Compliance: No SVHC; Dielectric Characteristic: X7R; Capacitance Tolerance: ±5%; Size-Length: 2.01 mm; Size-Height: 710 µm; Size-Thickness: 940 µm; Manufacturer Part Number: 08055C104JAT2A; Octopart URL: http://octopart.com/08055c104jat2a-avx-55388010; Operating Temperature: -55°C ~ 125°C
C16 C17 C23 C28 = CAP,0805,Generic
C18 C41 = Cap,0805,1nF,±5%,100Vdc,CL10F104ZB8NNNC: CAPACITOR, 1NF, 100V, NP0, 0805; Capacitance Tolerance: ±5%; Dielectric Characteristic: C0G/NP0; Dielectric Material: Ceramic; Lead-Free Status: Lead Free; Case/Package: 0805; Mounting Style: Surface Mount; Octopart Url: https://octopart.com/c0805x102j1gacauto-kemet-23280135; Packaging: Cut Tape (CT); REACH SVHC Compliance: No SVHC; RoHS: Compliant; mfg P/N: C0805X102J1GACAUTO; Supplier 1: Digi-Key; Supplier Part Number 1: 399-19430-1-ND
C21 C24-C27 = Cap,0805,100nf,50V,5%,08055C104JAT2A: as C7 on sheet MelansonTech Boost PSU_IsolatedShuntAmp; Mounting Style: Surface Mount; Packaging: Tape & Reel (TR), Cut Tape (CT); RoHS: Compliant; Size-Width: 1.24 mm; Case/Package: 0805; Number of Pins: 2; digikey url: http://www.digikey.ca/product-detail/en/avx-corporation/08055C104JAT2A/478-3352-1-ND/930144; REACH SVHC Compliance: No SVHC; Dielectric Characteristic: X7R; Capacitance Tolerance: ±5%; Size-Length: 2.01 mm; Size-Height: 710 µm; Size-Thickness: 940 µm; Manufacturer Part Number: 08055C104JAT2A; Octopart URL: http://octopart.com/08055c104jat2a-avx-55388010; Operating Temperature: -55°C ~ 125°C; Supplier 1: Digi-Key; Supplier Part Number 1: 478-3352-1-ND
D4 D5 = LED,TH,T1,3mm,Blue,OVLBB4C7: Blue 470nm LED Indication - Discrete 3.2V Radial; Mfg: TT Electronics/Optek Technology; Product Status: Active; Configuration: Standard; Lens Color: Colorless; Lens Transparency: Clear; Millicandela Rating: 1800mcd; Lens Style: Round with Domed Top; Lens Size: 3mm, T-1; Current - Test: 20mA; Viewing Angle: 45°; Base Product Number: OVLBB4; Category: Optoelectronics  LED Indication - Discrete; Color: Blue; Voltage - Forward (Vf) (Typ): 3.2V; Mounting Type: Through Hole; Wavelength - Dominant: 470nm; Package / Case: Radial; Supplier Device Package: 3mm; Height (Max): 5.35mm
D6 = Diode,Shottky,Array,Series,30V,200mA,BAT54SLT1G: Diode Array 1 Pair Series Connection Schottky 30V 200mA (DC) Surface Mount TO-236-3, SC-59, SOT-23-3; Manufacturer: ON Semiconductor; Voltage - Forward (Vf) (Max) @ If: 800mV @ 100mA; Speed: Small Signal =< 200mA (Io), Any Speed; Reverse Recovery Time (trr): 5ns; Current - Reverse Leakage @ Vr: 2µA @ 25V; Detailed Description: Diode Array 1 Pair Series Connection Schottky 30V 200mA (DC) Surface Mount TO-236-3, SC-59, SOT-23-3; mfg P/N: BAT54SLT1G; Diode Type: Schottky; Diode Configuration: 1 Pair Series Connection; Voltage - DC Reverse (Vr) (Max): 30V; Current - Average Rectified (Io) (per Diode): 200mA (DC); Operating Temperature - Junction: 125°C (Max); Mounting Type: Surface Mount; Package / Case: TO-236-3, SC-59, SOT-23-3; Supplier Device Package: SOT-23-3 (TO-236); Base Part Number: BAT54SL; Supplier 1: Digi-Key; Supplier Part Number 1: BAT54SLT1GOSCT-ND; Supplier 2: LCSC; Supplier Part Number 2: C19726
J1 = Conn,SMA,Female,End Launch,142-0701-801: CONN SMA JACK STR 50OHM EDGE MNT; Manufacturer: Cinch Connectivity Solutions Johnson; Detailed Description: SMA Connector Jack, Female Socket 50Ohm Board Edge, End Launch Solder; Connector: Style   SMA; Connector Type: Jack, Female Socket; Contact Termination: Solder; Body Material: Brass; Body Finish: Gold; Dielectric Material: Polytetrafluoroethylene (PTFE); Center Contact Material: Beryllium Copper; Mating Cycles: 500; Number of Ports: 1; Frequency - Max: 18GHz; Voltage Rating: 335V; mfg P/N: 142-0701-801; Category: Connectors, Interconnects  Coaxial Connectors (RF); Part Status: Active; Shield Termination: Solder; Impedance: 50Ohm; Mounting Type: Board Edge, End Launch; Fastening Type: Threaded; Housing Color: Gold; Center Contact Plating: Gold; Operating Temperature: -65°C ~ 165°C; Supplier 1: Digi-Key; Supplier Part Number 1: J502-ND
J2 = TERM BLOCK 2POS SIDE ENTRY 5MM, 282836-2: Wire to Board 2 Position 5 mm Pitch 30-16 AWG Euro Style Terminal Block; Voltage Rating (AC): 250.0 V; ELV Compliant: Compliant; Current Rating: 13.5 A; Number of Contacts: 2; Pin Pitch: 0.005 m; Lead-Free Status: Lead Free; Wire Gauge: 15.0 AWG; RoHS: Compliant; Contact Material: Brass; Contact Plating: Tin; Color: Green; Manufacturer Part Number: 282836-2; Flammability Rating: UL 94 V-0; Mounting Style: PCB; Housing Material: Nylon 6/6; Insulation Material: Nylon; Housing Color: Green; Orientation: Right Angle; Lifecycle Status: Active; REACH SVHC Compliance: No SVHC; Number of Positions: 2; Supplier 1: TME; Supplier 2: Newark; Supplier 3: Digi-Key; Supplier 4: Digi-Key; Supplier Part Number 4: A98076-ND
Logo1 = Symbol,Open Source: Open Source Silk Screen Logo
Q1 Q2 Q4 = MOSFET,N-Channel,SOT23,0.25A,60V,2N7002ET1G: Small Signal MOSFET, 60 V, 310 mA, Single, N-Channel, 3-Pin SOT-23, Pb-Free, Tape and Reel; Manufacturer: ON Semiconductor; Continuous Drain Current (Ids): 0.25A; Lead-Free Status: Lead Free; Drain to Source Voltage (Vds): 60.0 V; Power Dissipation (Max): 350mW (Ta); REACH SVHC Compliance: No SVHC; Number of Pins: 3; Halogen Free Status: Halogen Free; Case/Package: SOT-23-3; Polarity: N-Channel; RoHS: Compliant; Lifecycle Status: Active; Supplier 1: Digi-Key; Supplier Part Number 1: 2N7002ET1GOSCT-ND; Supplier 2: LCSC; Supplier Part Number 2: C71533; Manufacturer Part Number: 2N7002ET1G
R1 R12 = Res,0805,10.0Ω,5%,±200ppm/°C,RMCF0805JT10R0: RES 10 OHM 5% 1/8W 0805; Manufacturer: Stackpole Electronics Inc; Detailed Description: 10 Ohms ±5% 0.125W, 1/8W Chip Resistor 0805 (2012 Metric) Automotive AEC-Q200 Thick Film; Categories: Resistors   Chip Resistor - Surface Mount; Power (Watts): 0.125W, 1/8W; mfg P/N: RMCF0805JT10R0; Part Status: Active; Series: RMCF; Tolerance: ±5%; Composition: Thick Film; Features: Automotive AEC-Q200; Temperature Coefficient: ±200ppm/°C; Operating Temperature: -55°C ~ 155°C; Package / Case: 0805 (2012 Metric); Ratings: AEC-Q200; Supplier Device Package: 0805; Supplier 1: Digi-Key; Supplier Part Number 1: RMCF0805JT10R0CT-ND
R2 R9 = Res,0805,8.25KΩ,0.5%,±25ppm/°C,RR1220P-8251-D-M: RES SMD 8.25KOHM 0.5% 1/10W 0805; Manufacturer: Susumu; Detailed Description: 8.25 kOhms ±0.5% 0.1W, 1/10W Chip Resistor 0805 (2012 Metric) Thin Film; Power (Watts): 0.1W, 1/10W; mfg P/N: RR1220P-8251-D-M; Category: Resistors  Chip Resistor - Surface Mount; Mfr: Susumu; Series: RR; Part Status: Active; Composition: Thin Film; Operating Temperature: -55°C ~ 125°C; Package / Case: 0805 (2012 Metric); Size / Dimension: 0.079"" L x 0.049"" W (2.00mm x 1.25mm); Height - Seated (Max): 0.020"" (0.50mm); Number of Terminations: 2
R3 R13 R15 R19 R20 R27 R32 = Res,0805,10.0kΩ,1%,100 ppm,CRCW080510K0FKTA: as R21 on sheet MelansonTech Boost PSU_IsolatedShuntAmp; Size-Width: 0.00125 m; Resistance Tolerance: 1%; Size-Length: 0.002 m; RoHS: Non-Compliant; Power Dissipation: 0.125 W; Number of Pins: 2; REACH SVHC Compliance: No SVHC; Size-Height: 0.00045 m; Case/Package: 0805; Mounting Style: Surface Mount; Supplier 1: Digi-Key; Supplier Part Number 1: 541-3016-1-ND
R4 R8 = Res,0805,100Ω,5%,±200ppm/°C: RES 100 OHM 5% 1/8W 0805; Lead-Free Status: Lead Free; Power Rating: 0.125 W; Detailed Description: 100 Ohms ±5% 0.125W, 1/8W Chip Resistor 0805 (2012 Metric) Thick Film; Case/Package: 0805 (2012 Metric); Number of Pins: 2; RoHS: Compliant; mfg P/N: CRCW0805100RJNEAC; Tolerance: ±5%; Temperature Coefficient: ±200ppm/°C; Operating Temperature: -55°C ~ 155°C; Supplier 1: Digi-Key; Supplier Part Number 1: 541-100ACT-ND
R5 = Res,2512,10mΩ,3.00W,±1%,CRA2512-FZ-R010ELF: Resistor; Metal Film; Res 0.01 Ohms; Pwr-Rtg 3 W; Tol 1%; SMT; 2512; Current Sense; Case/Package (SI): 2512; Resistance Tolerance: ±1%; Octopart URL: http://octopart.com/cra2512-fz-r010elf-bourns-7483589; Manufacturer Part Number: CRA2512-FZ-R010ELF; Packaging: Tape & Reel (TR), Cut Tape (CT); REACH SVHC Compliance: No SVHC; RoHS: Compliant; Number of Pins: 2; Mounting Style: Surface Mount; Case/Package: 1005
R6 R24 R30 R31 = Res,0805,Generic: PPM: *; Wattage: *
R7 R10 R11 R14 R16 R18 = res,0805,470Ω,5%,200ppm,CR0805-JW-471ELF: RES SMD 470 OHM 5% 1/8W 0805; Manufacturer: Bourns Inc.; Detailed Description: 470 Ohms ±5% 0.125W, 1/8W Chip Resistor 0805 (2012 Metric) Moisture Resistant Thick Film; Categories: Resistors   Chip Resistor - Surface Mount; Power (Watts): 0.125W, 1/8W; Temperature Coefficient: ±200ppm/°C; mfg P/N: CR0805-JW-471ELF; Part Status: Active; Tolerance: ±5%; Composition: Thick Film; Features: Moisture Resistant; Operating Temperature: -55°C ~ 155°C; Package / Case: 0805 (2012 Metric); Supplier Device Package: 0805; Size / Dimension: 0.079" L x 0.049" W (2.00mm x 1.25mm); Height - Seated (Max): 0.024" (0.60mm); Number of Terminations: 2; Base Part Number: CR0805; Supplier 1: Digi-Key; Supplier Part Number 1: 118-CR0805-JW-471ELFCT-ND
R17 R22 R26 R29 = Res,0805,100kΩ,1%,100ppm,CRCW0805100KFKEA: 100 kOhms ±1% 0.125W, 1/8W Chip Resistor 0805 (2012 Metric) Thick Film; Manufacturer: Vishay; Lead-Free Status: Lead Free; Case/Package (SI): 2012; Power Rating: 125 mW; Temperature Coefficient: -100 ppm/°C to 100 ppm/°C; Resistance Tolerance: ±1%; RoHS: Compliant; Manufacturer Part Number: CRCW0805100KFKEA; Number of Pins: 2; Size-Length: 2.00 mm; Packaging: Tape & Reel (TR), Reel, Cut Tape (CT); Size-Height: 450 µm; Case/Package: 0805; Size-Width: 1.25 mm; Operating Temperature: 150 °C (max); Supplier 1 Part Number: 679-0803; Supplier 1: RS; Supplier 2: Digi-Key; Supplier Part Number 2: 541-100KCCT-ND
R28 = Res,POT,SMD,100Ω,0.1W, TC33X-2-101E: TRIMMER 100 OHM 0.1W J LEAD TOP; Manufacturer: Bourns Inc.; Detailed Description: 100 Ohms 0.1W, 1/10W J Lead Surface Mount Trimmer Potentiometer Cermet 1 Turn Top Adjustment; Power (Watts): 0.1W, 1/10W; Tolerance: ±25%; Temperature Coefficient: ±250ppm/°C; Adjustment Type: Top Adjustment; Resistive Material: Cermet; Number of Turns: 1; mfg P/N: TC33X-2-101E; Datasheets: TC33 Series; Category: Potentiometers, Variable Resistors  Trimmer Potentiometers; Series: Trimpot® TC33 - Open Frame; Part Status: Active; Mounting Type: Surface Mount; Termination Style: J Lead; Size / Dimension: Rectangular - 0.150"" x 0.142"" Face x 0.047"" H (3.80mm x 3.60mm x 1.20mm); Supplier 1: Digi-Key; Supplier 2: Digi-Key; Supplier Part Number 2: TC33X-101EDKR-ND
U2 = IC,CurrentSense,Isolated,8.1Gain,950Khz, SI8920BC-IS: Isolation IC Inverters, Power Supplies, UPS 16-SOIC; Mfr: Skyworks Solutions Inc.; Detailed Description: Isolation IC Automotive, Inverters, Power Supplies, UPS 8-DIP Gull Wing; Base Product Number: SI8920; Category: Integrated Circuits (ICs)  Linear - Amplifiers - Special Purpose; Part Status: Active; Type: Isolation; Applications: Automotive, Inverters, Power Supplies, UPS; Mounting Type: Surface Mount; Package / Case: 16-SOIC (0.295", 7.50mm Width); Supplier Device Package: 16-SOIC; Mfg P/N: SI8920BC-IS
U3 U8 = OPAMP, single, General Purpose,Rail-to-Rail,10MHz,SOT-23-5,OPA197IDBVT: General Purpose Amplifier 1 Circuit Rail-to-Rail SOT-23-5; Manufacturer: Texas Instruments; Supply Current: 1mA; Number of Channels: 1; Slew Rate: 20V/μs; Gain Bandwidth Product: 10MHz; Voltage - Input Offset: 25uV; Current - Output / Channel: 65mA; Current - Input Bias: 5pA; Voltage - Supply, Single/Dual (±): 4.5 V ~ 36 V, ±2.25 V ~ 18 V; REACH SVHC Compliance: No SVHC; Operating Temperature: -40°C ~ 125°C; Supplier Device Package: SOT-23-5; Supplier 1: LCSC; Supplier Part Number 1: C131929; Supplier 2: Digi-Key; Supplier Part Number 2: 296-44076-6-ND; Mfg P/N: OPA197IDBVT
U5 U9 = OPAMP,20Mhz,MOSFET DRIVER,SOT23-5,LM7321MF: Single Rail-to-Rail Input/Output, ±15V, High Output Current and Unlimited Capacitive Load Operational Amplifier, 5-pin SOT-23, Pb-Free; Bandwidth: 20000000.0 Hz; Input Offset Drift: 2e-06 V/K; Lead-Free Status: Lead Free; Number of Channels: 1; Output Current: 0.06 A; Slew Rate: 18.0 V/μs; Case/Package: SOIC; Gain Bandwidth Product: 20000000.0 Hz; Lifecycle Status: Active; Mounting Style: Surface Mount; Number of Pins: 5; Packaging: Tape & Reel (TR); REACH SVHC Compliance: No SVHC; RoHS: Compliant; mfg P/N: LM7321MF/NOPB; Supplier 1: Digi-Key; Supplier Part Number 1: LM7321MF/NOPBCT-ND; Supplier 2: LCSC; Supplier Part Number 2: C128614

## Nets that join several sheets
+5: MelansonTech Boost PSU_IsolatedShuntAmp (5 pins), MelansonTech Isolated Shunt Amplifier (C2.2 U2.14)
+5_ISO: MelansonTech Boost PSU_IsolatedShuntAmp (C13.2 C14.2 C20.2 Mod1.4), MelansonTech Isolated Shunt Amplifier (C1.2 U2.1)
+12: MelansonTech Boost PSU_IsolatedShuntAmp (C32.2 C33.2 R23.1 U1.1), MelansonTech Isolated Shunt Amplifier (12 pins)
GND: MelansonTech Boost PSU_IsolatedShuntAmp (23 pins), MelansonTech Isolated Shunt Amplifier (20 pins)
GND_ISO: MelansonTech Boost PSU_IsolatedShuntAmp (5 pins), MelansonTech Isolated Shunt Amplifier (C1.1 NT1.2 U2.4 U2.8)
ISenseRTN: MelansonTech Boost PSU_IsolatedShuntAmp (C29.1 C30.2), MelansonTech Isolated Shunt Amplifier (8 pins)
HighRange: MelansonTech Boost PSU_IsolatedShuntAmp (D3.1 R23.2 SW1.3), MelansonTech Isolated Shunt Amplifier (Q1.1 Q2.1)